# Altium project 48FE+2GE+2SFP.PrjPcb (part 5 of 9)

## Sheet 17_FE_PORT_17-24.SchDoc
size 594 x 420 mm; Author: Serbinov O.A.; CompanyName: ELSICOM; DrawnBy: Serbinov O.A.; Engineer: Serbinov O.A.; Organization: Elsicom; Address1: Kirova avenue, 58; Address2: Tomsk; Address3: Russia 634012; DocumentNumber: 18; SheetNumber: 18; SheetTotal: 44; ProjectName: 48_PORTS
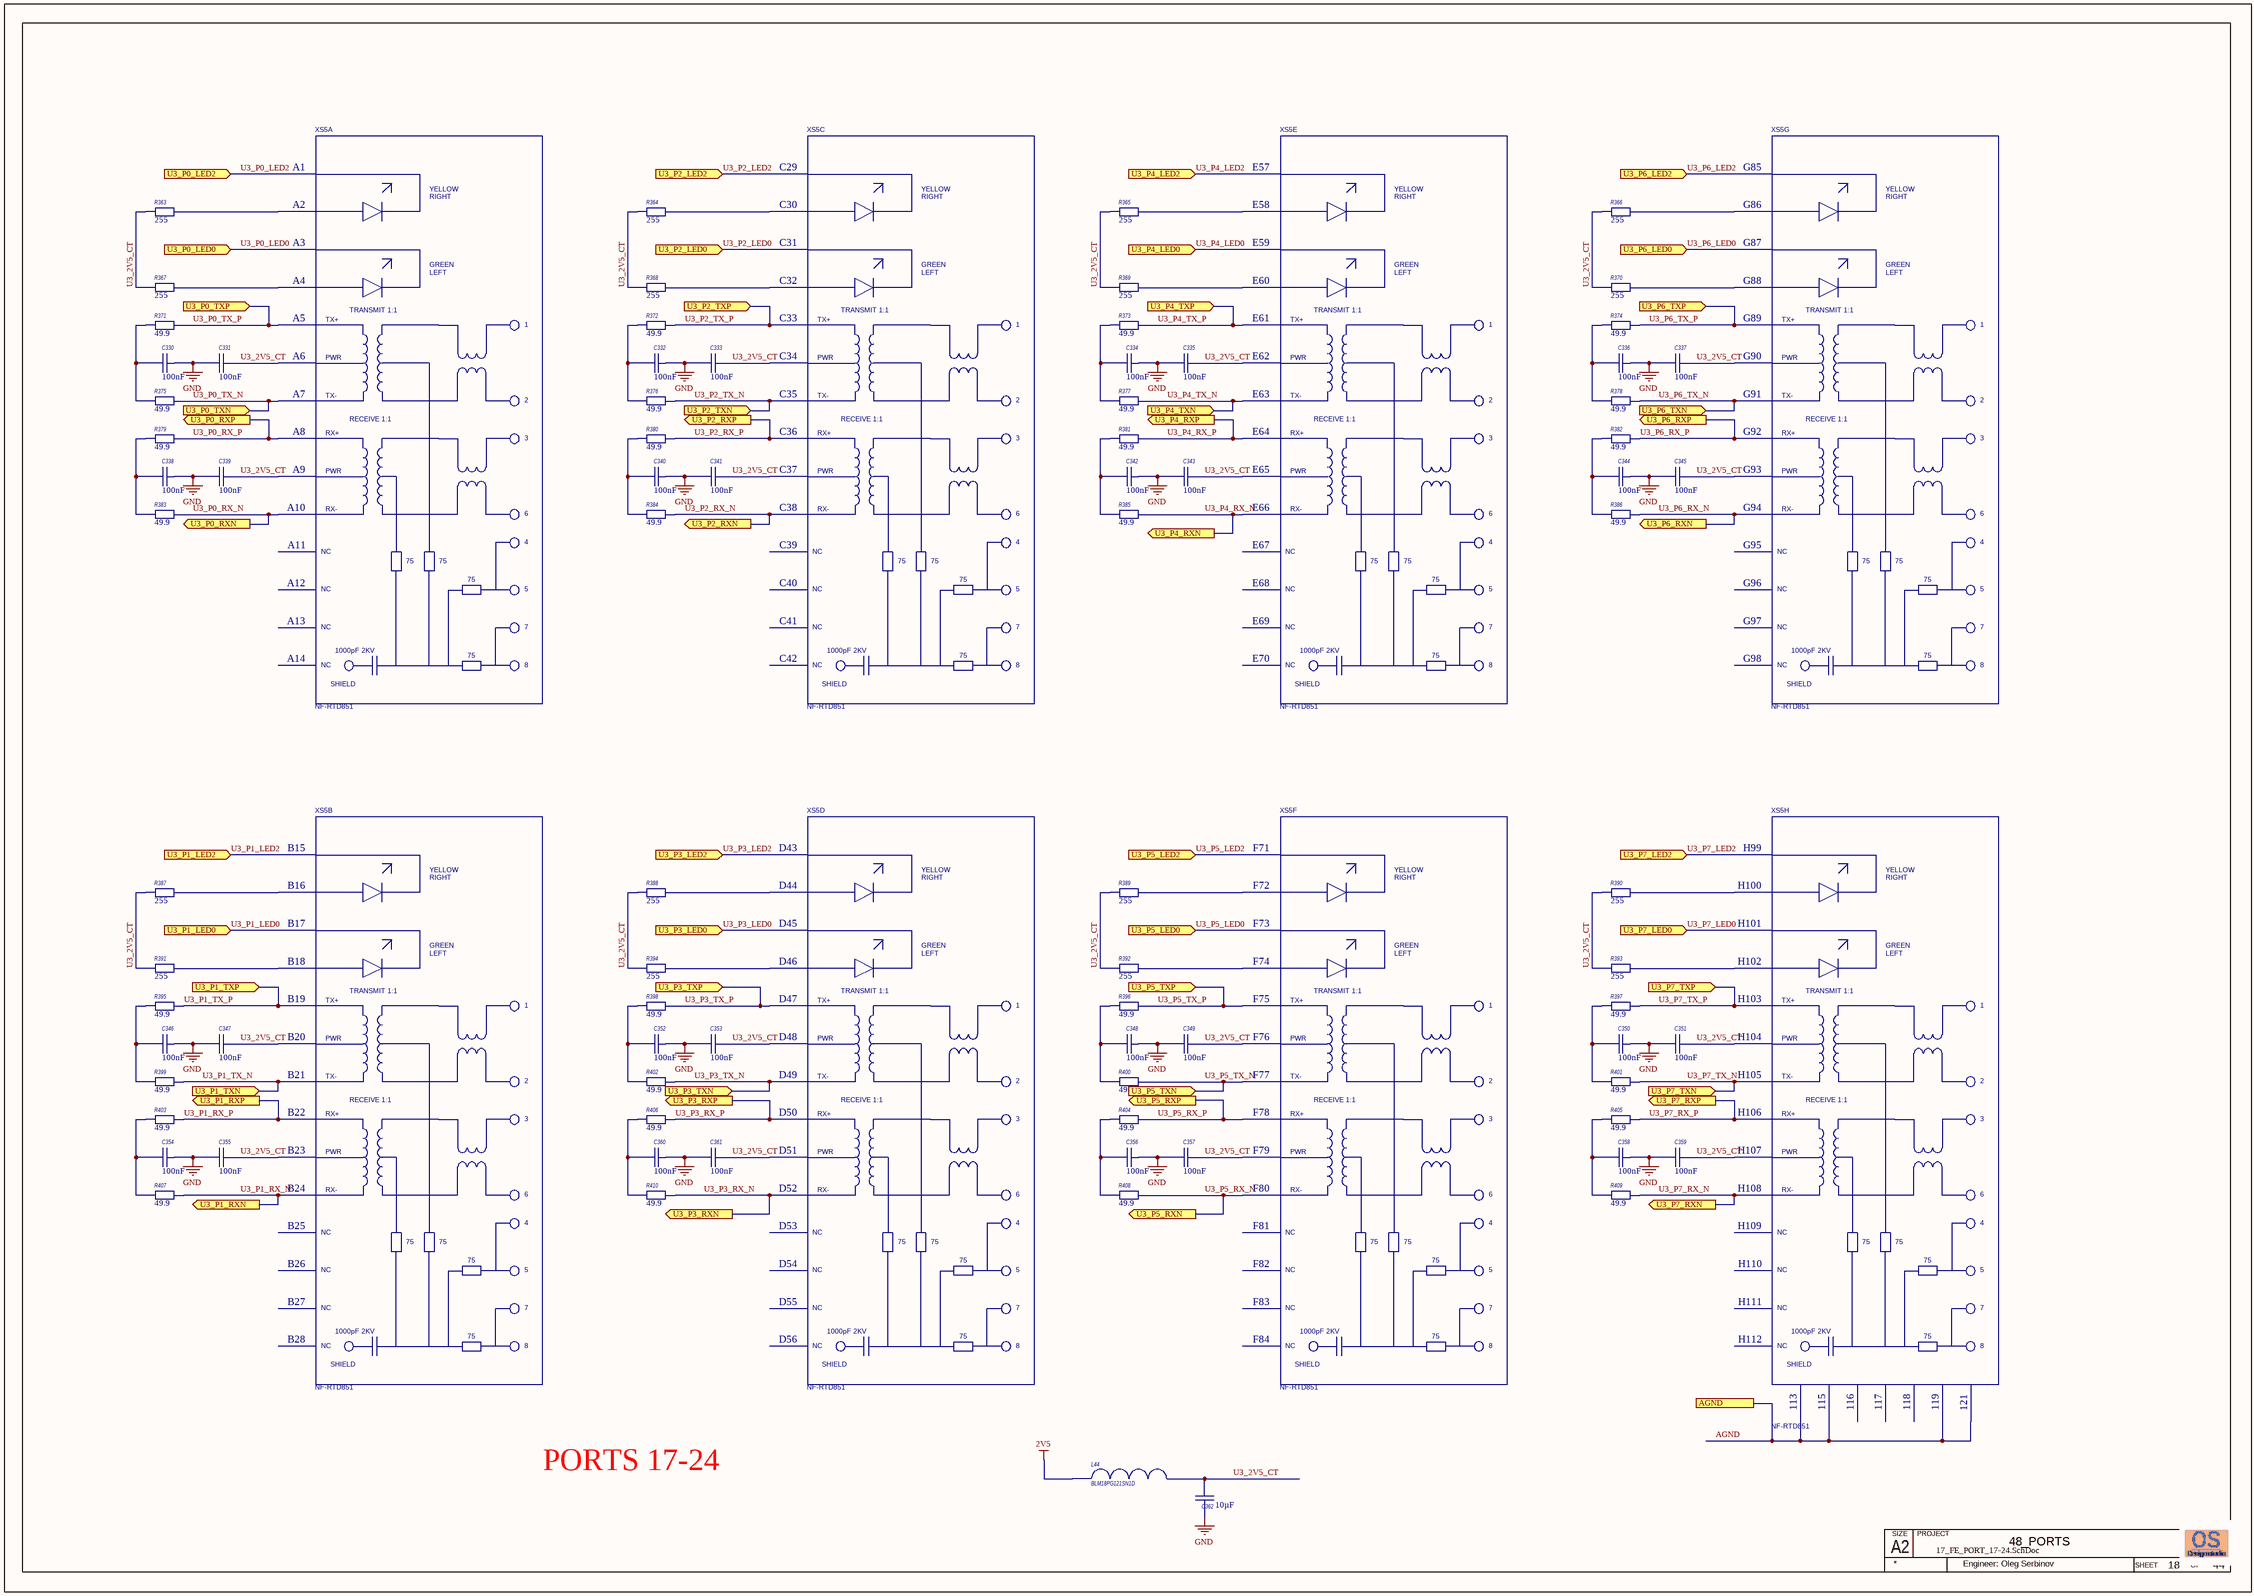
[diagram p11: 17_FE_PORT_17-24.SchDoc]

### Parts
C330  Capacitance: 100nF  [C0402_IPC High Density]  (hidden comment: GRM155R71E104KE14D)
C331  Capacitance: 100nF  [C0402_IPC High Density]  (hidden comment: GRM155R71E104KE14D)
C332  Capacitance: 100nF  [C0402_IPC High Density]  (hidden comment: GRM155R71E104KE14D)
C333  Capacitance: 100nF  [C0402_IPC High Density]  (hidden comment: GRM155R71E104KE14D)
C334  Capacitance: 100nF  [C0402_IPC High Density]  (hidden comment: GRM155R71E104KE14D)
C335  Capacitance: 100nF  [C0402_IPC High Density]  (hidden comment: GRM155R71E104KE14D)
C336  Capacitance: 100nF  [C0402_IPC High Density]  (hidden comment: GRM155R71E104KE14D)
C337  Capacitance: 100nF  [C0402_IPC High Density]  (hidden comment: GRM155R71E104KE14D)
C338  Capacitance: 100nF  [C0402_IPC High Density]  (hidden comment: GRM155R71E104KE14D)
C339  Capacitance: 100nF  [C0402_IPC High Density]  (hidden comment: GRM155R71E104KE14D)
C340  Capacitance: 100nF  [C0402_IPC High Density]  (hidden comment: GRM155R71E104KE14D)
C341  Capacitance: 100nF  [C0402_IPC High Density]  (hidden comment: GRM155R71E104KE14D)
C342  Capacitance: 100nF  [C0402_IPC High Density]  (hidden comment: GRM155R71E104KE14D)
C343  Capacitance: 100nF  [C0402_IPC High Density]  (hidden comment: GRM155R71E104KE14D)
C344  Capacitance: 100nF  [C0402_IPC High Density]  (hidden comment: GRM155R71E104KE14D)
C345  Capacitance: 100nF  [C0402_IPC High Density]  (hidden comment: GRM155R71E104KE14D)
C346  Capacitance: 100nF  [C0402_IPC High Density]  (hidden comment: GRM155R71E104KE14D)
C347  Capacitance: 100nF  [C0402_IPC High Density]  (hidden comment: GRM155R71E104KE14D)
C348  Capacitance: 100nF  [C0402_IPC High Density]  (hidden comment: GRM155R71E104KE14D)
C349  Capacitance: 100nF  [C0402_IPC High Density]  (hidden comment: GRM155R71E104KE14D)
C350  Capacitance: 100nF  [C0402_IPC High Density]  (hidden comment: GRM155R71E104KE14D)
C351  Capacitance: 100nF  [C0402_IPC High Density]  (hidden comment: GRM155R71E104KE14D)
C352  Capacitance: 100nF  [C0402_IPC High Density]  (hidden comment: GRM155R71E104KE14D)
C353  Capacitance: 100nF  [C0402_IPC High Density]  (hidden comment: GRM155R71E104KE14D)
C354  Capacitance: 100nF  [C0402_IPC High Density]  (hidden comment: GRM155R71E104KE14D)
C355  Capacitance: 100nF  [C0402_IPC High Density]  (hidden comment: GRM155R71E104KE14D)
C356  Capacitance: 100nF  [C0402_IPC High Density]  (hidden comment: GRM155R71E104KE14D)
C357  Capacitance: 100nF  [C0402_IPC High Density]  (hidden comment: GRM155R71E104KE14D)
C358  Capacitance: 100nF  [C0402_IPC High Density]  (hidden comment: GRM155R71E104KE14D)
C359  Capacitance: 100nF  [C0402_IPC High Density]  (hidden comment: GRM155R71E104KE14D)
C360  Capacitance: 100nF  [C0402_IPC High Density]  (hidden comment: GRM155R71E104KE14D)
C361  Capacitance: 100nF  [C0402_IPC High Density]  (hidden comment: GRM155R71E104KE14D)
C362  Capacitance: 10µF  [CAPC2012[0805]]  (hidden comment: GRM21BR61C106KE15)
L44  BLM18PG121SN1D  [INDC1608X95N]
R363  Resistance (Ohms): 255  [RESC1005[0402]]  (hidden comment: ERJ-2RKF2550X)
R364  Resistance (Ohms): 255  [RESC1005[0402]]  (hidden comment: ERJ-2RKF2550X)
R365  Resistance (Ohms): 255  [RESC1005[0402]]  (hidden comment: ERJ-2RKF2550X)
R366  Resistance (Ohms): 255  [RESC1005[0402]]  (hidden comment: ERJ-2RKF2550X)
R367  Resistance (Ohms): 255  [RESC1005[0402]]  (hidden comment: ERJ-2RKF2550X)
R368  Resistance (Ohms): 255  [RESC1005[0402]]  (hidden comment: ERJ-2RKF2550X)
R369  Resistance (Ohms): 255  [RESC1005[0402]]  (hidden comment: ERJ-2RKF2550X)
R370  Resistance (Ohms): 255  [RESC1005[0402]]  (hidden comment: ERJ-2RKF2550X)
R371  Resistance: 49.9  [R0402_IPC High Density]  (hidden comment: ERJ-2RKF49R9X)
R372  Resistance: 49.9  [R0402_IPC High Density]  (hidden comment: ERJ-2RKF49R9X)
R373  Resistance: 49.9  [R0402_IPC High Density]  (hidden comment: ERJ-2RKF49R9X)
R374  Resistance: 49.9  [R0402_IPC High Density]  (hidden comment: ERJ-2RKF49R9X)
R375  Resistance: 49.9  [R0402_IPC High Density]  (hidden comment: ERJ-2RKF49R9X)
R376  Resistance: 49.9  [R0402_IPC High Density]  (hidden comment: ERJ-2RKF49R9X)
R377  Resistance: 49.9  [R0402_IPC High Density]  (hidden comment: ERJ-2RKF49R9X)
R378  Resistance: 49.9  [R0402_IPC High Density]  (hidden comment: ERJ-2RKF49R9X)
R379  Resistance: 49.9  [R0402_IPC High Density]  (hidden comment: ERJ-2RKF49R9X)
R380  Resistance: 49.9  [R0402_IPC High Density]  (hidden comment: ERJ-2RKF49R9X)
R381  Resistance: 49.9  [R0402_IPC High Density]  (hidden comment: ERJ-2RKF49R9X)
R382  Resistance: 49.9  [R0402_IPC High Density]  (hidden comment: ERJ-2RKF49R9X)
R383  Resistance: 49.9  [R0402_IPC High Density]  (hidden comment: ERJ-2RKF49R9X)
R384  Resistance: 49.9  [R0402_IPC High Density]  (hidden comment: ERJ-2RKF49R9X)
R385  Resistance: 49.9  [R0402_IPC High Density]  (hidden comment: ERJ-2RKF49R9X)
R386  Resistance: 49.9  [R0402_IPC High Density]  (hidden comment: ERJ-2RKF49R9X)
R387  Resistance (Ohms): 255  [RESC1005[0402]]  (hidden comment: ERJ-2RKF2550X)
R388  Resistance (Ohms): 255  [RESC1005[0402]]  (hidden comment: ERJ-2RKF2550X)
R389  Resistance (Ohms): 255  [RESC1005[0402]]  (hidden comment: ERJ-2RKF2550X)
R390  Resistance (Ohms): 255  [RESC1005[0402]]  (hidden comment: ERJ-2RKF2550X)
R391  Resistance (Ohms): 255  [RESC1005[0402]]  (hidden comment: ERJ-2RKF2550X)
R392  Resistance (Ohms): 255  [RESC1005[0402]]  (hidden comment: ERJ-2RKF2550X)
R393  Resistance (Ohms): 255  [RESC1005[0402]]  (hidden comment: ERJ-2RKF2550X)
R394  Resistance (Ohms): 255  [RESC1005[0402]]  (hidden comment: ERJ-2RKF2550X)
R395  Resistance: 49.9  [R0402_IPC High Density]  (hidden comment: ERJ-2RKF49R9X)
R396  Resistance: 49.9  [R0402_IPC High Density]  (hidden comment: ERJ-2RKF49R9X)
R397  Resistance: 49.9  [R0402_IPC High Density]  (hidden comment: ERJ-2RKF49R9X)
R398  Resistance: 49.9  [R0402_IPC High Density]  (hidden comment: ERJ-2RKF49R9X)
R399  Resistance: 49.9  [R0402_IPC High Density]  (hidden comment: ERJ-2RKF49R9X)
R400  Resistance: 49.9  [R0402_IPC High Density]  (hidden comment: ERJ-2RKF49R9X)
R401  Resistance: 49.9  [R0402_IPC High Density]  (hidden comment: ERJ-2RKF49R9X)
R402  Resistance: 49.9  [R0402_IPC High Density]  (hidden comment: ERJ-2RKF49R9X)
R403  Resistance: 49.9  [R0402_IPC High Density]  (hidden comment: ERJ-2RKF49R9X)
R404  Resistance: 49.9  [R0402_IPC High Density]  (hidden comment: ERJ-2RKF49R9X)
R405  Resistance: 49.9  [R0402_IPC High Density]  (hidden comment: ERJ-2RKF49R9X)
R406  Resistance: 49.9  [R0402_IPC High Density]  (hidden comment: ERJ-2RKF49R9X)
R407  Resistance: 49.9  [R0402_IPC High Density]  (hidden comment: ERJ-2RKF49R9X)
R408  Resistance: 49.9  [R0402_IPC High Density]  (hidden comment: ERJ-2RKF49R9X)
R409  Resistance: 49.9  [R0402_IPC High Density]  (hidden comment: ERJ-2RKF49R9X)
R410  Resistance: 49.9  [R0402_IPC High Density]  (hidden comment: ERJ-2RKF49R9X)
XS5  NF-RTD851  [NF-RTD851_2X4_LED_NF-RTD851_2X4_LED(Primary)]  (parts A,B,C,D,E,F,G,H of 8)

### Ports
AGND, U3_P0_LED0 (in), U3_P0_LED2 (in), U3_P0_RXN (out), U3_P0_RXP (out), U3_P0_TXN (in), U3_P0_TXP (in), U3_P1_LED0 (in), U3_P1_LED2 (in), U3_P1_RXN (out), U3_P1_RXP (out), U3_P1_TXN (in), U3_P1_TXP (in), U3_P2_LED0 (in), U3_P2_LED2 (in), U3_P2_RXN (out), U3_P2_RXP (out), U3_P2_TXN (in), U3_P2_TXP (in), U3_P3_LED0 (in), U3_P3_LED2 (in), U3_P3_RXN (out), U3_P3_RXP (out), U3_P3_TXN (in), U3_P3_TXP (in), U3_P4_LED0 (in), U3_P4_LED2 (in), U3_P4_RXN (out), U3_P4_RXP (out), U3_P4_TXN (in), U3_P4_TXP (in), U3_P5_LED0 (in), U3_P5_LED2 (in), U3_P5_RXN (out), U3_P5_RXP (out), U3_P5_TXN (in), U3_P5_TXP (in), U3_P6_LED0 (in), U3_P6_LED2 (in), U3_P6_RXN (out), U3_P6_RXP (out), U3_P6_TXN (in), U3_P6_TXP (in), U3_P7_LED0 (in), U3_P7_LED2 (in), U3_P7_RXN (out), U3_P7_RXP (out), U3_P7_TXN (in), U3_P7_TXP (in)

### Nets
2V5: L44.1
GND: C330.2 C331.1 C332.2 C333.1 C334.2 C335.1 C336.2 C337.1 C338.2 C339.1 C340.2 C341.1 C342.2 C343.1 C344.2 C345.1 C346.2 C347.1 C348.2 C349.1 C350.2 C351.1 C352.2 C353.1 C354.2 C355.1 C356.2 C357.1 C358.2 C359.1 C360.2 C361.1 C362.1
AGND: XS5.113 XS5.115 XS5.119 XS5.121 ; port AGND
U3_2V5_CT: C331.2 C333.2 C335.2 C337.2 C339.2 C341.2 C343.2 C345.2 C347.2 C349.2 C351.2 C353.2 C355.2 C357.2 C359.2 C361.2 C362.2 L44.2 R363.1 R364.1 R365.1 R366.1 R367.1 R368.1 R369.1 R370.1 R387.1 R388.1 R389.1 R390.1 R391.1 R392.1 R393.1 R394.1 XS5.A6 XS5.A9 XS5.B20 XS5.B23 XS5.C34 XS5.C37 XS5.D48 XS5.D51 XS5.E62 XS5.E65 XS5.F76 XS5.F79 XS5.G90 XS5.G93 XS5.H104 XS5.H107
U3_P0_LED0: XS5.A3 ; port U3_P0_LED0
U3_P0_LED2: XS5.A1 ; port U3_P0_LED2
U3_P0_RX_N: R383.2 XS5.A10 ; port U3_P0_RXN
U3_P0_RX_P: R379.2 XS5.A8 ; port U3_P0_RXP
U3_P0_TX_N: R375.2 XS5.A7 ; port U3_P0_TXN
U3_P0_TX_P: R371.2 XS5.A5 ; port U3_P0_TXP
U3_P1_LED0: XS5.B17 ; port U3_P1_LED0
U3_P1_LED2: XS5.B15 ; port U3_P1_LED2  [project net U3_CONFIG_8]
U3_P1_RX_N: R407.2 XS5.B24 ; port U3_P1_RXN
U3_P1_RX_P: R403.2 XS5.B22 ; port U3_P1_RXP
U3_P1_TX_N: R399.2 XS5.B21 ; port U3_P1_TXN
U3_P1_TX_P: R395.2 XS5.B19 ; port U3_P1_TXP
U3_P2_LED0: XS5.C31 ; port U3_P2_LED0
U3_P2_LED2: XS5.C29 ; port U3_P2_LED2
U3_P2_RX_N: R384.2 XS5.C38 ; port U3_P2_RXN
U3_P2_RX_P: R380.2 XS5.C36 ; port U3_P2_RXP
U3_P2_TX_N: R376.2 XS5.C35 ; port U3_P2_TXN
U3_P2_TX_P: R372.2 XS5.C33 ; port U3_P2_TXP
U3_P3_LED0: XS5.D45 ; port U3_P3_LED0
U3_P3_LED2: XS5.D43 ; port U3_P3_LED2
U3_P3_RX_N: R410.2 XS5.D52 ; port U3_P3_RXN
U3_P3_RX_P: R406.2 XS5.D50 ; port U3_P3_RXP
U3_P3_TX_N: R402.2 XS5.D49 ; port U3_P3_TXN
U3_P3_TX_P: R398.2 XS5.D47 ; port U3_P3_TXP
U3_P4_LED0: XS5.E59 ; port U3_P4_LED0
U3_P4_LED2: XS5.E57 ; port U3_P4_LED2
U3_P4_RX_N: R385.2 XS5.E66 ; port U3_P4_RXN
U3_P4_RX_P: R381.2 XS5.E64 ; port U3_P4_RXP
U3_P4_TX_N: R377.2 XS5.E63 ; port U3_P4_TXN
U3_P4_TX_P: R373.2 XS5.E61 ; port U3_P4_TXP
U3_P5_LED0: XS5.F73 ; port U3_P5_LED0
U3_P5_LED2: XS5.F71 ; port U3_P5_LED2
U3_P5_RX_N: R408.2 XS5.F80 ; port U3_P5_RXN
U3_P5_RX_P: R404.2 XS5.F78 ; port U3_P5_RXP
U3_P5_TX_N: R400.2 XS5.F77 ; port U3_P5_TXN
U3_P5_TX_P: R396.2 XS5.F75 ; port U3_P5_TXP
U3_P6_LED0: XS5.G87 ; port U3_P6_LED0
U3_P6_LED2: XS5.G85 ; port U3_P6_LED2
U3_P6_RX_N: R386.2 XS5.G94 ; port U3_P6_RXN
U3_P6_RX_P: R382.2 XS5.G92 ; port U3_P6_RXP
U3_P6_TX_N: R378.2 XS5.G91 ; port U3_P6_TXN
U3_P6_TX_P: R374.2 XS5.G89 ; port U3_P6_TXP
U3_P7_LED0: XS5.H101 ; port U3_P7_LED0
U3_P7_LED2: XS5.H99 ; port U3_P7_LED2
U3_P7_RX_N: R409.2 XS5.H108 ; port U3_P7_RXN
U3_P7_RX_P: R405.2 XS5.H106 ; port U3_P7_RXP
U3_P7_TX_N: R401.2 XS5.H105 ; port U3_P7_TXN
U3_P7_TX_P: R397.2 XS5.H103 ; port U3_P7_TXP
NetC330_1: C330.1 R371.1 R375.1
NetC332_1: C332.1 R372.1 R376.1
NetC334_1: C334.1 R373.1 R377.1
NetC336_1: C336.1 R374.1 R378.1
NetC338_1: C338.1 R379.1 R383.1
NetC340_1: C340.1 R380.1 R384.1
NetC342_1: C342.1 R381.1 R385.1
NetC344_1: C344.1 R382.1 R386.1
NetC346_1: C346.1 R395.1 R399.1
NetC348_1: C348.1 R396.1 R400.1
NetC350_1: C350.1 R397.1 R401.1
NetC352_1: C352.1 R398.1 R402.1
NetC354_1: C354.1 R403.1 R407.1
NetC356_1: C356.1 R404.1 R408.1
NetC358_1: C358.1 R405.1 R409.1
NetC360_1: C360.1 R406.1 R410.1
NetR363_2: R363.2 XS5.A2
NetR364_2: R364.2 XS5.C30
NetR365_2: R365.2 XS5.E58
NetR366_2: R366.2 XS5.G86
NetR367_2: R367.2 XS5.A4
NetR368_2: R368.2 XS5.C32
NetR369_2: R369.2 XS5.E60
NetR370_2: R370.2 XS5.G88
NetR387_2: R387.2 XS5.B16
NetR388_2: R388.2 XS5.D44
NetR389_2: R389.2 XS5.F72
NetR390_2: R390.2 XS5.H100
NetR391_2: R391.2 XS5.B18
NetR392_2: R392.2 XS5.F74
NetR393_2: R393.2 XS5.H102
NetR394_2: R394.2 XS5.D46

Not connected (* = marked no-connect by the designer): XS5 114 116 117 118 120 A11 A12 A13 A14 B25 B26 B27 B28 C39 C40 C41 C42 D53 D54 D55 D56 E67 E68 E69 E70 F81 F82 F83 F84 G95 G96 G97 G98 H109 H110 H111 H112

### Notes on the sheet
- PORTS 17-24
- A2
- SIZE
- PROJECT
- SHEET
- OF
- Engineer: Oleg Serbinov
- (in symbol NF-RTD851 2X4 EMI LED, part A) YELLOW; RIGHT; GREEN; LEFT; TRANSMIT 1:1; TX+; 1; PWR; TX-; 2; RECEIVE 1:1; RX+; 3; RX-; 6; 4; NC; 75; 5; 7; 1000pF 2KV; 8; SHIELD
- (in symbol NF-RTD851 2X4 EMI LED, part B) YELLOW; RIGHT; GREEN; LEFT; TRANSMIT 1:1; TX+; 1; PWR; TX-; 2; RECEIVE 1:1; RX+; 3; RX-; 6; 4; NC; 75; 5; 7; 1000pF 2KV; 8; SHIELD
- (in symbol NF-RTD851 2X4 EMI LED, part C) YELLOW; RIGHT; GREEN; LEFT; TRANSMIT 1:1; TX+; 1; PWR; TX-; 2; RECEIVE 1:1; RX+; 3; RX-; 6; 4; NC; 75; 5; 7; 1000pF 2KV; 8; SHIELD
- (in symbol NF-RTD851 2X4 EMI LED, part D) YELLOW; RIGHT; GREEN; LEFT; TRANSMIT 1:1; TX+; 1; PWR; TX-; 2; RECEIVE 1:1; RX+; 3; RX-; 6; 4; NC; 75; 5; 7; 1000pF 2KV; 8; SHIELD
- (in symbol NF-RTD851 2X4 EMI LED, part E) YELLOW; RIGHT; GREEN; LEFT; TRANSMIT 1:1; TX+; 1; PWR; TX-; 2; RECEIVE 1:1; RX+; 3; RX-; 6; 4; NC; 75; 5; 7; 1000pF 2KV; 8; SHIELD
- (in symbol NF-RTD851 2X4 EMI LED, part F) YELLOW; RIGHT; GREEN; LEFT; TRANSMIT 1:1; TX+; 1; PWR; TX-; 2; RECEIVE 1:1; RX+; 3; RX-; 6; 4; NC; 75; 5; 7; 1000pF 2KV; 8; SHIELD
- (in symbol NF-RTD851 2X4 EMI LED, part G) YELLOW; RIGHT; GREEN; LEFT; TRANSMIT 1:1; TX+; 1; PWR; TX-; 2; RECEIVE 1:1; RX+; 3; RX-; 6; 4; NC; 75; 5; 7; 1000pF 2KV; 8; SHIELD
- (in symbol NF-RTD851 2X4 EMI LED, part H) YELLOW; RIGHT; GREEN; LEFT; TRANSMIT 1:1; TX+; 1; PWR; TX-; 2; RECEIVE 1:1; RX+; 3; RX-; 6; 4; NC; 75; 5; 7; 1000pF 2KV; 8; SHIELD

### Library data of the parts
C330-C361 = GRM155R71E104KE14D: C0402, 100nF, 25V, X7R; Manufacturer: Murata; Rmanufacturer: Yageo  Samsung  TDK  Taiyo Yuden  Kemet; Customer Part Number: Конденсатор, 100n, 0402, 25V, X7R, 10%; Capacitance Tolerance: ± 10%; Voltage Rating: 16; Capacitor Case Style: 0402 [1005 Metric]; Capacitor Terminals: SMD; SVHC: No SVHC (19-Dec-2012); No. of Pins: 2; Reel Quantity: 10000; Tolerance +: 10%; Analogs: any suitable; Manufacturer Part Number: GRM155R71E104KE14D; RoHS: YES; Packaging: Reel; Package / Case: 0402; ComponentLink1URL: http://www.farnell.com/datasheets/4360.pdf; ComponentLink1Description: http://www.farnell.com/datasheets/4360.pdf; Pricing: 10000=0.008593, 30000=0.007991 (GBP); Supplier 1: Farnell; Supplier Part Number 1: 1118151; Stock: 3; Dielectric Characteristic: X7R; Operating Temperature Min: -55; Operating Temperature Max: 125; Operating Temperature Range: -55°C to +125; Series: GRM Hi-Cap; Terminal Type: Surface Mount (SMD, SMT); Tolerance -: 10%; Voltage Rating V DC: 16
C362 = GRM21BR61C106KE15: C0805, 10uF 10%, 16V, X5R; Manufacturer: Murata; Customer Part Number: Конденсатор, 10u, 0805, 16V, X5R, 10%; Analogs: any suitable; Applications: General Purpose; Category: Capacitors; Operating Temperature: -55°C ~ 85°C; Package / Case: 0805 (2012 Metric); Size / Dimension: 0.079" L x 0.049" W (2.00mm x 1.25mm); Temperature Coefficient: X5R; Tolerance: ±10%; ComponentLink1URL: http://search.murata.co.jp/Ceramy/image/img/PDF/ENG/GRM21BR61C106KE15.pdf; ComponentLink1Description: http://search.murata.co.jp/Ceramy/image/img/PDF/ENG/GRM21BR61C106KE15.pdf; Pricing: 1=0.3, 10=0.25, 50=0.1408, 100=0.1252, 250=0.09392, 500=0.08294, 1000=0.07356 (USD); Voltage - Rated: 16V; Manufacturer Part Number: GRM21BR61C106KE15
L44 = BLM18PG121SN1D: FILTER BLM18 (0603, 2A); Manufacturer: Murata; Rpart number: MPZ1608S121ATAH0 ; CIC10P121NC ; MPZ1608S121ATDH5 ; BLM18PG121SH1D ; 742792625; Rmanufacturer: Boruns  Samsung  TDK  Murata  Wurth Electronics; Customer Part Number: Дроссель, BLM18PG121SN1D, FERRITE BEAD 120 OHM 1LN, 0603; DC Resistance Max: 0.05; Impedance: 120; Ferrite Mounting: SMD; Inductor Type: Ferrite Bead; SVHC: No SVHC (19-Dec-2011); Ferrite Case Style: 0603 / 1608; Core Material: Ferrite; DC Current Max: 2000; Inductor Case Style: 0603; Inductance Tolerance: ± 25%; No. of Pins: 2; RoHS: YES; Operating Temperature Min: -55; Mounting Type: SMD; Operating Temperature Max: +125; Package / Case: 0603; Impedance @ 100MHz Typ: 120; Resistance: 0.05; Supplier Part Number: 1515738; Supplier: Farnell; ComponentLink1URL: http://www.farnell.com/datasheets/5148.pdf; ComponentLink1Description: http://www.farnell.com/datasheets/5148.pdf; Pricing: 5=0.056, 50=0.041, 100=0.034, 250=0.028, 500=0.027 (GBP); Manufacturer Part Number: BLM18PG121SN1D; DC Current Rating: 2A; Analogs: MPZ1608S121ATAH0 ; CIC10P121NC ; MPZ1608S121ATDH5 ; BLM18PG121SH1D ; 742792625
R363-R370 R387-R394 = ERJ-2RKF2550X: R0402, 255R 1%; Manufacturer: Panasonic; Customer Part Number: Резистор, 255R, 0402, 1%; Temperature Coefficient: ±100ppm/°C; Power (Watts): 0.1W, 1/10W; Analogs: any suitable; Category: Resistors; Supplier: Digi-Key; Supplier Part Number: P255LDKR-ND; RoHS: RoHS Compliant; Manufacturer Part Number: ERJ-2RKF2550X; Packaging: Digi-Reel®; Composition: Thick Film; Number of Terminations: 2; Height: 0.016" (0.40mm); Size / Dimension: 0.039" L x 0.020" W (1.00mm x 0.50mm); Tolerance: ±1%; Features: -; Package / Case: 0402 (1005 Metric); ComponentLink1URL: http://industrial.panasonic.com/www-cgi/jvcr13pz.cgi?E+PZ+3+AOA0002+ERJ2RKF2550X+7+WW; ComponentLink1Description: http://industrial.panasonic.com/www-cgi/jvcr13pz.cgi?E+PZ+3+AOA0002+ERJ2RKF2550X+7+WW; Pricing: 1=0.1, 50=0.0242, 100=0.0184, 250=0.01364, 500=0.01008, 1000=0.00672, 5000=0.00473 (USD)
R371-R386 R395-R410 = ERJ-2RKF49R9X: R0402, 49.9R 1%; Manufacturer: Panasonic; Rpart number: RC0402FR-0749R9L ; RC1005F49R9CS ; MCR01MRTF49R9 ; CRCW040249R9FKED ; CR0402-FX-49R9GLF; Rmanufacturer: Yageo  Samsung  Stackpole Electronics  Rohm Semiconductor  Vishay Dale; Customer Part Number: Резистор, 49R9, 0402, 1%; Temperature Coefficient: 100 PPM / C; Voltage Rating: 50 Volts; Power Rating: 100 mWatts; Analogs: any suitable; Category: Thick Film Resistors - SMD; Supplier: Mouser; Supplier Part Number: 667-ERJ-2RKF49R9X; Manufacturer Part Number: ERJ-2RKF49R9X; Product Category: .; Minimum Order Quantity: 1; Series: ERJ; Product: Thick Film Resistors SMD; RoHS - Mouser: E; Reeling: True; Packaging: Reel; Termination Style: SMD/SMT; Package / Case: 0402 (1005 metric); Standard Pack Qty: 10000; Tolerance: 1 %; Operating Temperature Range: - 55 C to + 155 C; RoHS: RoHS Compliant By Exemption; Dimensions: 0.5 mm W x 1 mm L x 0.35 mm H; ComponentLink1URL: http://industrial.panasonic.com/www-data/pdf/AOA0000/AOA0000CE2.pdf; ComponentLink1Description: http://industrial.panasonic.com/www-data/pdf/AOA0000/AOA0000CE2.pdf; Pricing: 1=0.135, 25=0.032, 100=0.024, 250=0.018, 500=0.014, 1000=0.008, 2000=0.007, 5000=0.004 (AUD)
XS5 = NF-RTD851 2X4 EMI LED: Connector RJ45 100mb 8 ports and led  NF-RTD851; Customer Part Number: Разъем, NF-RTD851, CONN MAGJACK 8PORT 100 BASE-TX; Manufacturer: Shenzhen Newfly Electronics; NF-RTD851 2X4 EMI LED: NF-RTD851 2X4 EMI LED (100mb 8 ports and led); Analogs: SC863-F4-48-4222-C12, F4-48-4222-C12, 9812G-81015-8-S3L1TC-D; Manufacturer Part Number: NF-RTD851

## Sheet 22_PHY_GE_PP1.SchDoc
size 419 x 296 mm; Author: Serbinov O.A.; CompanyName: ELSICOM; DrawnBy: Serbinov O.A.; Engineer: Serbinov O.A.; Organization: Elsicom; Address1: Kirova avenue, 58; Address2: Tomsk; Address3: Russia 634012; DocumentNumber: 23; SheetNumber: 23; SheetTotal: 44; ProjectName: 48_PORTS
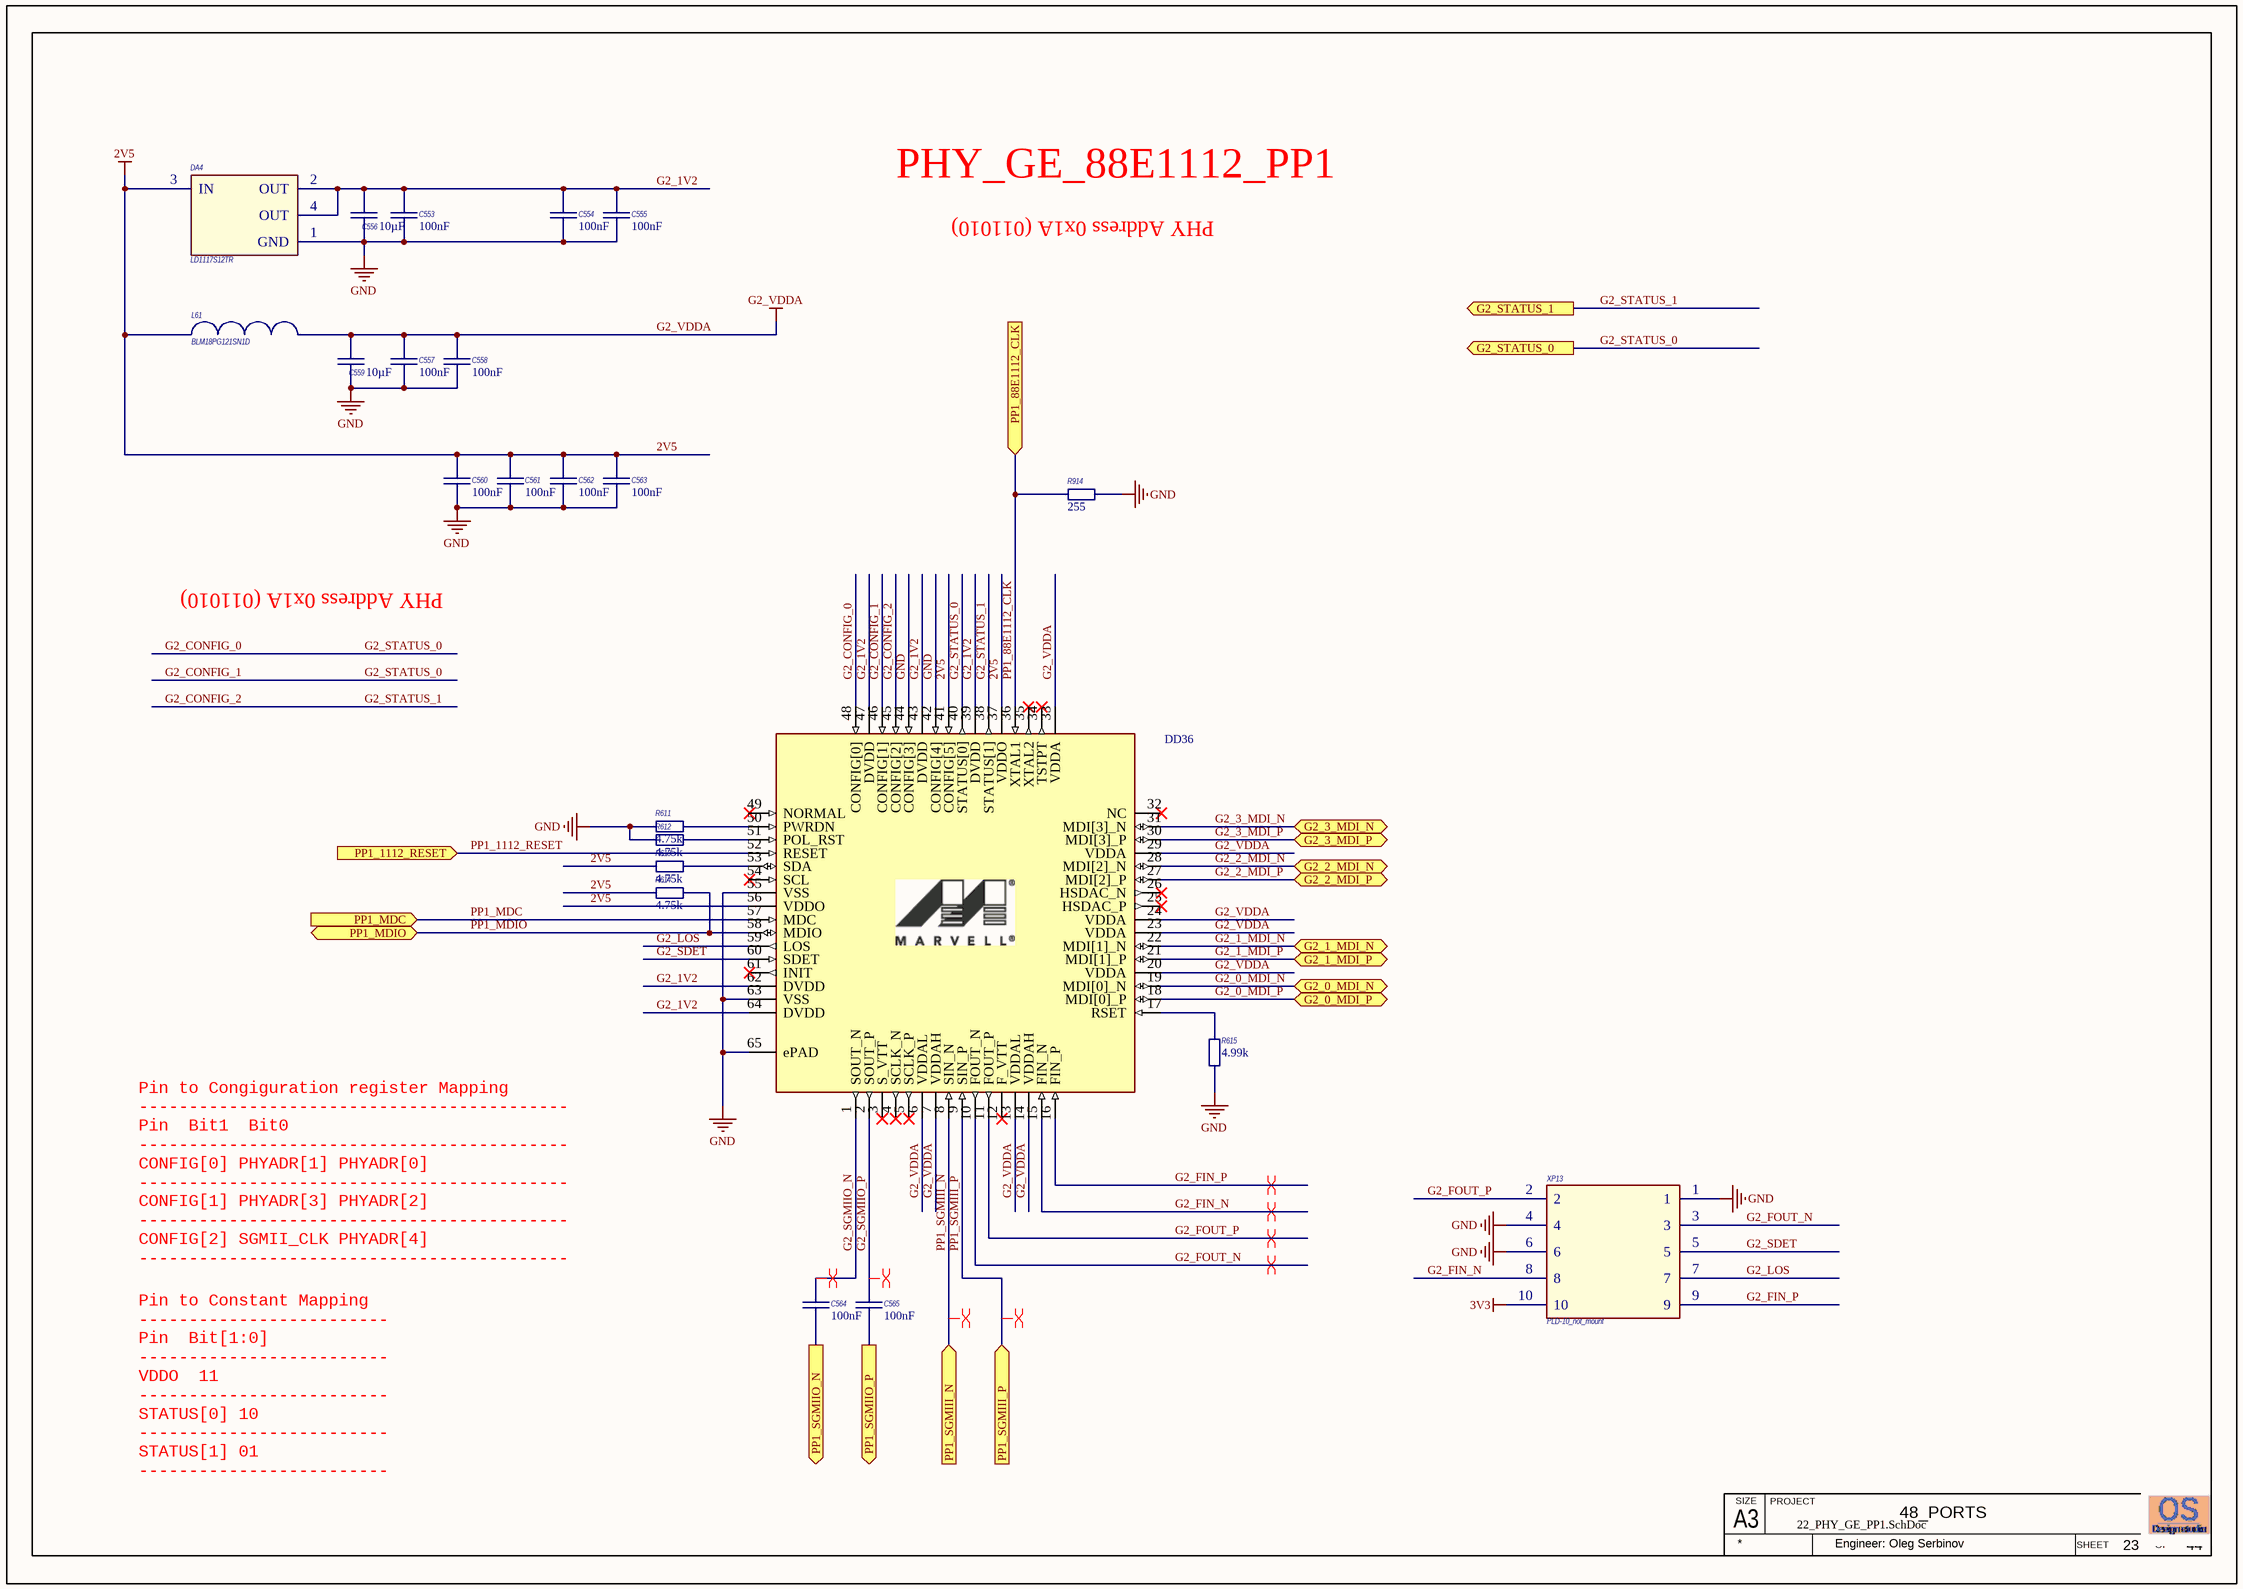
[diagram p12: 22_PHY_GE_PP1.SchDoc]

### Parts
C553  Capacitance: 100nF  [C0402_IPC High Density]  (hidden comment: GRM155R71E104KE14D)
C554  Capacitance: 100nF  [C0402_IPC High Density]  (hidden comment: GRM155R71E104KE14D)
C555  Capacitance: 100nF  [C0402_IPC High Density]  (hidden comment: GRM155R71E104KE14D)
C556  Capacitance: 10µF  [CAPC2012[0805]]  (hidden comment: GRM21BR61C106KE15)
C557  Capacitance: 100nF  [C0402_IPC High Density]  (hidden comment: GRM155R71E104KE14D)
C558  Capacitance: 100nF  [C0402_IPC High Density]  (hidden comment: GRM155R71E104KE14D)
C559  Capacitance: 10µF  [CAPC2012[0805]]  (hidden comment: GRM21BR61C106KE15)
C560  Capacitance: 100nF  [C0402_IPC High Density]  (hidden comment: GRM155R71E104KE14D)
C561  Capacitance: 100nF  [C0402_IPC High Density]  (hidden comment: GRM155R71E104KE14D)
C562  Capacitance: 100nF  [C0402_IPC High Density]  (hidden comment: GRM155R71E104KE14D)
C563  Capacitance: 100nF  [C0402_IPC High Density]  (hidden comment: GRM155R71E104KE14D)
C564  Capacitance: 100nF  [C0402_IPC High Density]  (hidden comment: GRM155R71E104KE14D)
C565  Capacitance: 100nF  [C0402_IPC High Density]  (hidden comment: GRM155R71E104KE14D)
DA4  LD1117S12TR  [SOT223_N]
DD36  88E1112-C2-NNC1  [QFN50P900X900X100-64N]  (value not drawn)
L61  BLM18PG121SN1D  [INDC1608X95N]
R611  Resistance (Ohms): 4.75k  [R0402_IPC High Density]  (hidden comment: ERJ-2RKF4751X)
R612  Resistance (Ohms): 4.75k  [R0402_IPC High Density]  (hidden comment: ERJ-2RKF4751X)
R613  Resistance (Ohms): 4.75k  [R0402_IPC High Density]  (hidden comment: ERJ-2RKF4751X)
R614  Resistance (Ohms): 4.75k  [R0402_IPC High Density]  (hidden comment: ERJ-2RKF4751X)
R615  Resistance (Ohms): 4.99k  [R0402_IPC High Density]  (hidden comment: ERJ-2RKF4991X)
R914  Resistance (Ohms): 255  [RESC1005[0402]]  (hidden comment: ERJ-2RKF2550X)
XP13  PLD-10_not_mount  [PLD-10_not_mount]

### Ports
G2_0_MDI_N (bidir), G2_0_MDI_P (bidir), G2_1_MDI_N (bidir), G2_1_MDI_P (bidir), G2_2_MDI_N (bidir), G2_2_MDI_P (bidir), G2_3_MDI_N (bidir), G2_3_MDI_P (bidir), G2_STATUS_0 (out), G2_STATUS_1 (out), PP1_88E1112_CLK (in), PP1_1112_RESET (in), PP1_MDC (in), PP1_MDIO (bidir), PP1_SGMIII_N (in), PP1_SGMIII_P (in), PP1_SGMIIO_N (out), PP1_SGMIIO_P (out)

### Nets
2V5: C560.2 C561.2 C562.2 C563.2 DA4.3(IN) DD36.37(VDDO) DD36.41(CONFIG[5]) DD36.56(VDDO) L61.1 R613.1 R614.1
3V3: XP13.10
G2_VDDA: C557.2 C558.2 C559.2 DD36.6(VDDAL) DD36.7(VDDAH) DD36.13(VDDAL) DD36.14(VDDAH) DD36.20(VDDA) DD36.23(VDDA) DD36.24(VDDA) DD36.29(VDDA) DD36.33(VDDA) L61.2
GND: C553.1 C554.1 C555.1 C556.1 C557.1 C558.1 C559.1 C560.1 C561.1 C562.1 C563.1 DA4.1(GND) DD36.42(CONFIG[4]) DD36.44(CONFIG[3]) DD36.55(VSS) DD36.63(VSS) DD36.65(ePAD) R611.1 R612.1 R615.1 R914.1 XP13.1 XP13.4 XP13.6
G2_0_MDI_N: DD36.19(MDI[0]_N) ; port G2_0_MDI_N
G2_0_MDI_P: DD36.18(MDI[0]_P) ; port G2_0_MDI_P
G2_1_MDI_N: DD36.22(MDI[1]_N) ; port G2_1_MDI_N
G2_1_MDI_P: DD36.21(MDI[1]_P) ; port G2_1_MDI_P
G2_1V2: C553.2 C554.2 C555.2 C556.2 DA4.2(OUT) DA4.4(OUT) DD36.39(DVDD) DD36.43(DVDD) DD36.47(DVDD) DD36.62(DVDD) DD36.64(DVDD)
G2_2_MDI_N: DD36.28(MDI[2]_N) ; port G2_2_MDI_N
G2_2_MDI_P: DD36.27(MDI[2]_P) ; port G2_2_MDI_P
G2_3_MDI_N: DD36.31(MDI[3]_N) ; port G2_3_MDI_N
G2_3_MDI_P: DD36.30(MDI[3]_P) ; port G2_3_MDI_P
G2_CONFIG_0: DD36.40(STATUS[0]) DD36.46(CONFIG[1]) DD36.48(CONFIG[0]) ; port G2_STATUS_0  [also labelled G2_CONFIG_1, G2_STATUS_0]
G2_CONFIG_2: DD36.38(STATUS[1]) DD36.45(CONFIG[2]) ; port G2_STATUS_1  [also labelled G2_STATUS_1]
G2_FIN_N: DD36.15(FIN_N) XP13.8
G2_FIN_P: DD36.16(FIN_P) XP13.9
G2_FOUT_N: DD36.10(FOUT_N) XP13.3
G2_FOUT_P: DD36.11(FOUT_P) XP13.2
G2_LOS: DD36.59(LOS) XP13.7
G2_SDET: DD36.60(SDET) XP13.5
G2_SGMIIO_N: C564.1 DD36.1(SOUT_N)
G2_SGMIIO_P: C565.1 DD36.2(SOUT_P)
PP1_88E1112_CLK: DD36.36(XTAL1) R914.2 ; port PP1_88E1112_CLK
PP1_1112_RESET: DD36.52(RESET) ; port PP1_1112_RESET
PP1_MDC: DD36.57(MDC) ; port PP1_MDC
PP1_MDIO: DD36.58(MDIO) R614.2 ; port PP1_MDIO
PP1_SGMIII_N: DD36.8(SIN_N) ; port PP1_SGMIII_N
PP1_SGMIII_P: DD36.9(SIN_P) ; port PP1_SGMIII_P
NetC564_2: C564.2 ; port PP1_SGMIIO_N
NetC565_2: C565.2 ; port PP1_SGMIIO_P
NetDD36_17: DD36.17(RSET) R615.2
NetDD36_50: DD36.50(PWRDN) R611.2
NetDD36_51: DD36.51(POL_RST) R612.2
NetDD36_53: DD36.53(SDA) R613.2

Not connected (* = marked no-connect by the designer): DD36 3(S_VTT)* 4(SCLK_N)* 5(SCLK_P)* 12(F_VTT)* 25(HSDAC_P)* 26(HSDAC_N)* 32(NC)* 34(TSTPT)* 35(XTAL2)* 49(NORMAL)* 54(SCL)* 61(INIT)*

### Layout directives
differential pair: G2_FIN_N, G2_FIN_P, G2_FOUT_N, G2_FOUT_P, G2_SGMIIO_N, G2_SGMIIO_P, PP1_SGMIII_N, PP1_SGMIII_P

### Notes on the sheet
- PHY_GE_88E1112_PP1
- PHY Address 0x1A (011010)
- Pin to Congiguration register Mapping
  -------------------------------------------
  Pin		Bit1		Bit0
  -------------------------------------------
  CONFIG[0]	PHYADR[1]	PHYADR[0]
  -------------------------------------------
  CONFIG[1]	PHYADR[3]	PHYADR[2]
  -------------------------------------------
  CONFIG[2]	SGMII_CLK	PHYADR[4]
  -------------------------------------------
  CONFIG[3]	SEL_TWSI	SEL_VTT
  -------------------------------------------
  CONFIG[4]	EEPROM[1]	EEPROM[2]
  ------------------------------------------
- Pin to Constant Mapping
  -------------------------
  Pin		Bit[1:0]
  -------------------------
  VDDO		11
  -------------------------
  STATUS[0]	10
  -------------------------
  STATUS[1]	01
  -------------------------
  VSS		00
  -------------------------
- A3
- SIZE
- PROJECT
- SHEET
- OF
- Engineer: Oleg Serbinov

### Library data of the parts
C553-C555 C557 C558 C560-C565 = GRM155R71E104KE14D: as C330-C361 on sheet 17_FE_PORT_17-24; Manufacturer Part Number: GRM155R71E104KE14D; RoHS: YES; Packaging: Reel; Package / Case: 0402; ComponentLink1URL: http://www.farnell.com/datasheets/4360.pdf; ComponentLink1Description: http://www.farnell.com/datasheets/4360.pdf; Pricing: 10000=0.008593, 30000=0.007991 (GBP); Supplier 1: Farnell; Supplier Part Number 1: 1118151; Stock: 3; Dielectric Characteristic: X7R; Operating Temperature Min: -55; Operating Temperature Max: 125; Operating Temperature Range: -55°C to +125; Series: GRM Hi-Cap; Terminal Type: Surface Mount (SMD, SMT); Tolerance -: 10%; Voltage Rating V DC: 16
C556 C559 = GRM21BR61C106KE15: as C362 on sheet 17_FE_PORT_17-24; Applications: General Purpose; Category: Capacitors; Operating Temperature: -55°C ~ 85°C; Package / Case: 0805 (2012 Metric); Size / Dimension: 0.079" L x 0.049" W (2.00mm x 1.25mm); Temperature Coefficient: X5R; Tolerance: ±10%; ComponentLink1URL: http://search.murata.co.jp/Ceramy/image/img/PDF/ENG/GRM21BR61C106KE15.pdf; ComponentLink1Description: http://search.murata.co.jp/Ceramy/image/img/PDF/ENG/GRM21BR61C106KE15.pdf; Pricing: 1=0.3, 10=0.25, 50=0.1408, 100=0.1252, 250=0.09392, 500=0.08294, 1000=0.07356 (USD); Voltage - Rated: 16V; Manufacturer Part Number: GRM21BR61C106KE15
DA4 = LD1117S12TR: IC REG LDO 0.8A 1.2V SOT223-4; Manufacturer Part Number: LD1117S-12TR; Manufacturer: STMicroelectronics; Customer Part Number: Микросхема, LD1117S-12TR, IC REG LDO 1.2V 0.8A, SOT-223; Reference Voltage: 1.26 V; Input Voltage MAX: 15 V; Input Bias Current (Max): 5 mA; Output Current: 950 mA; Dropout Voltage (Max): 1.1 V; Line Regulation: 0.2 %; Load Regulation: 0.4 %; Maximum Power Dissipation: 12 W; Output Type: Fixed; Number of Outputs: 1; Voltage Regulation Accuracy: 1 %; LD1117S-12TR: LD1117S-12TR (SOT 223, LDO 1.2V 0.8A); Analogs: TLV117112D, LD1117AS12TR, MCP1826S-1202E/DB, AP1122EG-13, ZLDO1117G12TA, AZ1117BH-1.2TRE1; Supplier 1: Mouser; Supplier Part Number 1: 511-LD1117S12; Reeling: True; Minimum Order Quantity: 1; Category: Low Dropout (LDO) Regulators; Mounting Style: SMD/SMT; Supplier Part Number: 511-LD1117S12; Output Voltage: 1.2 V; RoHS: RoHS Compliant; Standard Pack Qty: 2500; RoHS - Mouser: Y; Packaging: Reel; Package / Case: SOT-223; Minimum Operating Temperature: 0 C; Maximum Operating Temperature: + 150 C; Supplier: Mouser; Product Category: Low Drop Voltage Regulators/Drivers; ComponentLink1URL: http://www.st.com/internet/com/TECHNICAL_RESOURCES/TECHNICAL_LITERATURE/DATASHEET/CD00000544.pdf; ComponentLink1Description: http://www.st.com/internet/com/TECHNICAL_RESOURCES/TECHNICAL_LITERATURE/DATASHEET/CD00000544.pdf; Pricing: 1=0.500, 10=0.446, 100=0.378, 250=0.358, 500=0.302, 1000=0.230, 2000=0.203, 2500=0.203, 5000=0.194, 10000=0.188 (AUD)
DD36 = 88E1112-C2-NNC1: IC GIGABIT PHY with Dual SGMII, 64-QFN Package; Manufacturer: Marvell; Manufacturer: Marvell Technology Group; Customer Part Number: Микросхема, 88E1112-C2-NNC1, IC GIGABIT PHY with Dual SGMII, 64-QFN; Manufacturer Part Number: 88E1112-C2-NNC1
L61 = BLM18PG121SN1D: as L44 on sheet 17_FE_PORT_17-24; RoHS: YES; Operating Temperature Min: -55; Mounting Type: SMD; Operating Temperature Max: +125; Package / Case: 0603; Impedance @ 100MHz Typ: 120; Resistance: 0.05; Supplier Part Number: 1515738; Supplier: Farnell; ComponentLink1URL: http://www.farnell.com/datasheets/5148.pdf; ComponentLink1Description: http://www.farnell.com/datasheets/5148.pdf; Pricing: 5=0.056, 50=0.041, 100=0.034, 250=0.028, 500=0.027 (GBP); Manufacturer Part Number: BLM18PG121SN1D; DC Current Rating: 2A; Analogs: MPZ1608S121ATAH0 ; CIC10P121NC ; MPZ1608S121ATDH5 ; BLM18PG121SH1D ; 742792625
R611-R614 = ERJ-2RKF4751X: R0402, 4.75k 1%; Manufacturer: Panasonic; Rpart number: RC0402FR-074K75L ; RC1005F4751CS ; RMCF0402FT4K75 ; CRCW04024K75FKED ; TRR01MZPF4751; Rmanufacturer: Yageo  Samsung  Stackpole Electronics  Rohm Semiconductor  Vishay Dale; Customer Part Number: Резистор, 4K75, 0402, 1%; Temperature Coefficient: ±100ppm/°C; Power (Watts): 0.1W, 1/10W; Analogs: any suitable; Tolerance: ±1%; Packaging: Cut Tape (CT); Package / Case: 0402 (1005 Metric); Category: Resistors; Manufacturer Part Number: ERJ-2RKF4751X; Supplier Part Number: P4.75KLCT-ND; RoHS: RoHS Compliant; Supplier: Digi-Key; ComponentLink1URL: http://industrial.panasonic.com/www-cgi/jvcr13pz.cgi?E+PZ+3+AOA0002+ERJ2RKF4751X+7+WW; ComponentLink1Description: http://industrial.panasonic.com/www-cgi/jvcr13pz.cgi?E+PZ+3+AOA0002+ERJ2RKF4751X+7+WW; Features: -; Composition: Thick Film; Height: 0.016" (0.40mm); Number of Terminations: 2; Supplier Device Package: 0402; Size / Dimension: 0.039" L x 0.020" W (1.00mm x 0.50mm)
R615 = ERJ-2RKF4991X: R0402, 4.99k 1%; Manufacturer: Panasonic; Customer Part Number: Резистор, 4K99, 0402, 1%; Description 1: RES 4.99K OHM 1/10W 1% 0402 SMD; Category 1: Resistors; Power (Watts): 0.1W, 1/10W; Temperature Coefficient: ±100ppm/°C; Analogs: any suitable; Supplier 1: Digi-Key; Supplier Part Number 1: P4.99KLTR-ND; RoHS 1: RoHS Compliant; Stock 1: 950000; Pricing 1: 10000=0.00347, 30000=0.00305, 50000=0.00279, 100000=0.00274 (USD); Composition: Thick Film; Features: -; Tolerance: ±1%; Package / Case: 0402 (1005 Metric); Size / Dimension: 0.039" L x 0.020" W (1.00mm x 0.50mm); Height: 0.016" (0.40mm); Number of Terminations: 2; Packaging: Tape & Reel (TR); ComponentLink1URL: http://industrial.panasonic.com/www-cgi/jvcr13pz.cgi?E+PZ+3+AOA0002+ERJ2RKF4991X+7+WW; ComponentLink1Description: http://industrial.panasonic.com/www-cgi/jvcr13pz.cgi?E+PZ+3+AOA0002+ERJ2RKF4991X+7+WW; Supplier Part Number: P4.99KLTR-ND; Manufacturer Part Number: ERJ-2RKF4991X; RoHS: RoHS Compliant; Supplier: Digi-Key; Category: Resistors; Pricing: 10000=0.00347, 30000=0.00305, 50000=0.00279, 100000=0.00274 (USD)
R914 = ERJ-2RKF2550X: as R363-R370 on sheet 17_FE_PORT_17-24; Category: Resistors; Manufacturer Part Number: ERJ-2RKF2550X; Tolerance: ±1%; Packaging: Digi-Reel®; Supplier: Digi-Key; RoHS: RoHS Compliant; Package / Case: 0402 (1005 Metric); ComponentLink1URL: http://industrial.panasonic.com/www-cgi/jvcr13pz.cgi?E+PZ+3+AOA0002+ERJ2RKF2550X+7+WW; ComponentLink1Description: http://industrial.panasonic.com/www-cgi/jvcr13pz.cgi?E+PZ+3+AOA0002+ERJ2RKF2550X+7+WW; Supplier Part Number: P255LDKR-ND; Pricing: 1=0.1, 50=0.0242, 100=0.0184, 250=0.01364, 500=0.01008, 1000=0.00672, 5000=0.00473 (USD); Composition: Thick Film; Number of Terminations: 2; Height: 0.016" (0.40mm); Size / Dimension: 0.039" L x 0.020" W (1.00mm x 0.50mm); Features: -
XP13 = PLD-10_not_mount: Connector PLD-10_not_mount; Customer Part Number: Разъем, PLD-10, 10 Positions Header Shrouded Connector 2.54mm Through Hole Gold; Analogs: any suitable; Manufacturer Part Number: PLD-10_not_mount; Notes: not_mount

## Sheet 23_SFP_PORTS.SchDoc
size 419 x 296 mm; Author: Serbinov O.A.; CompanyName: ELSICOM; DrawnBy: Serbinov O.A.; Engineer: Serbinov O.A.; Organization: Elsicom; Address1: Kirova avenue, 58; Address2: Tomsk; Address3: Russia 634012; DocumentNumber: 24; SheetNumber: 24; SheetTotal: 44; ProjectName: 48_PORTS
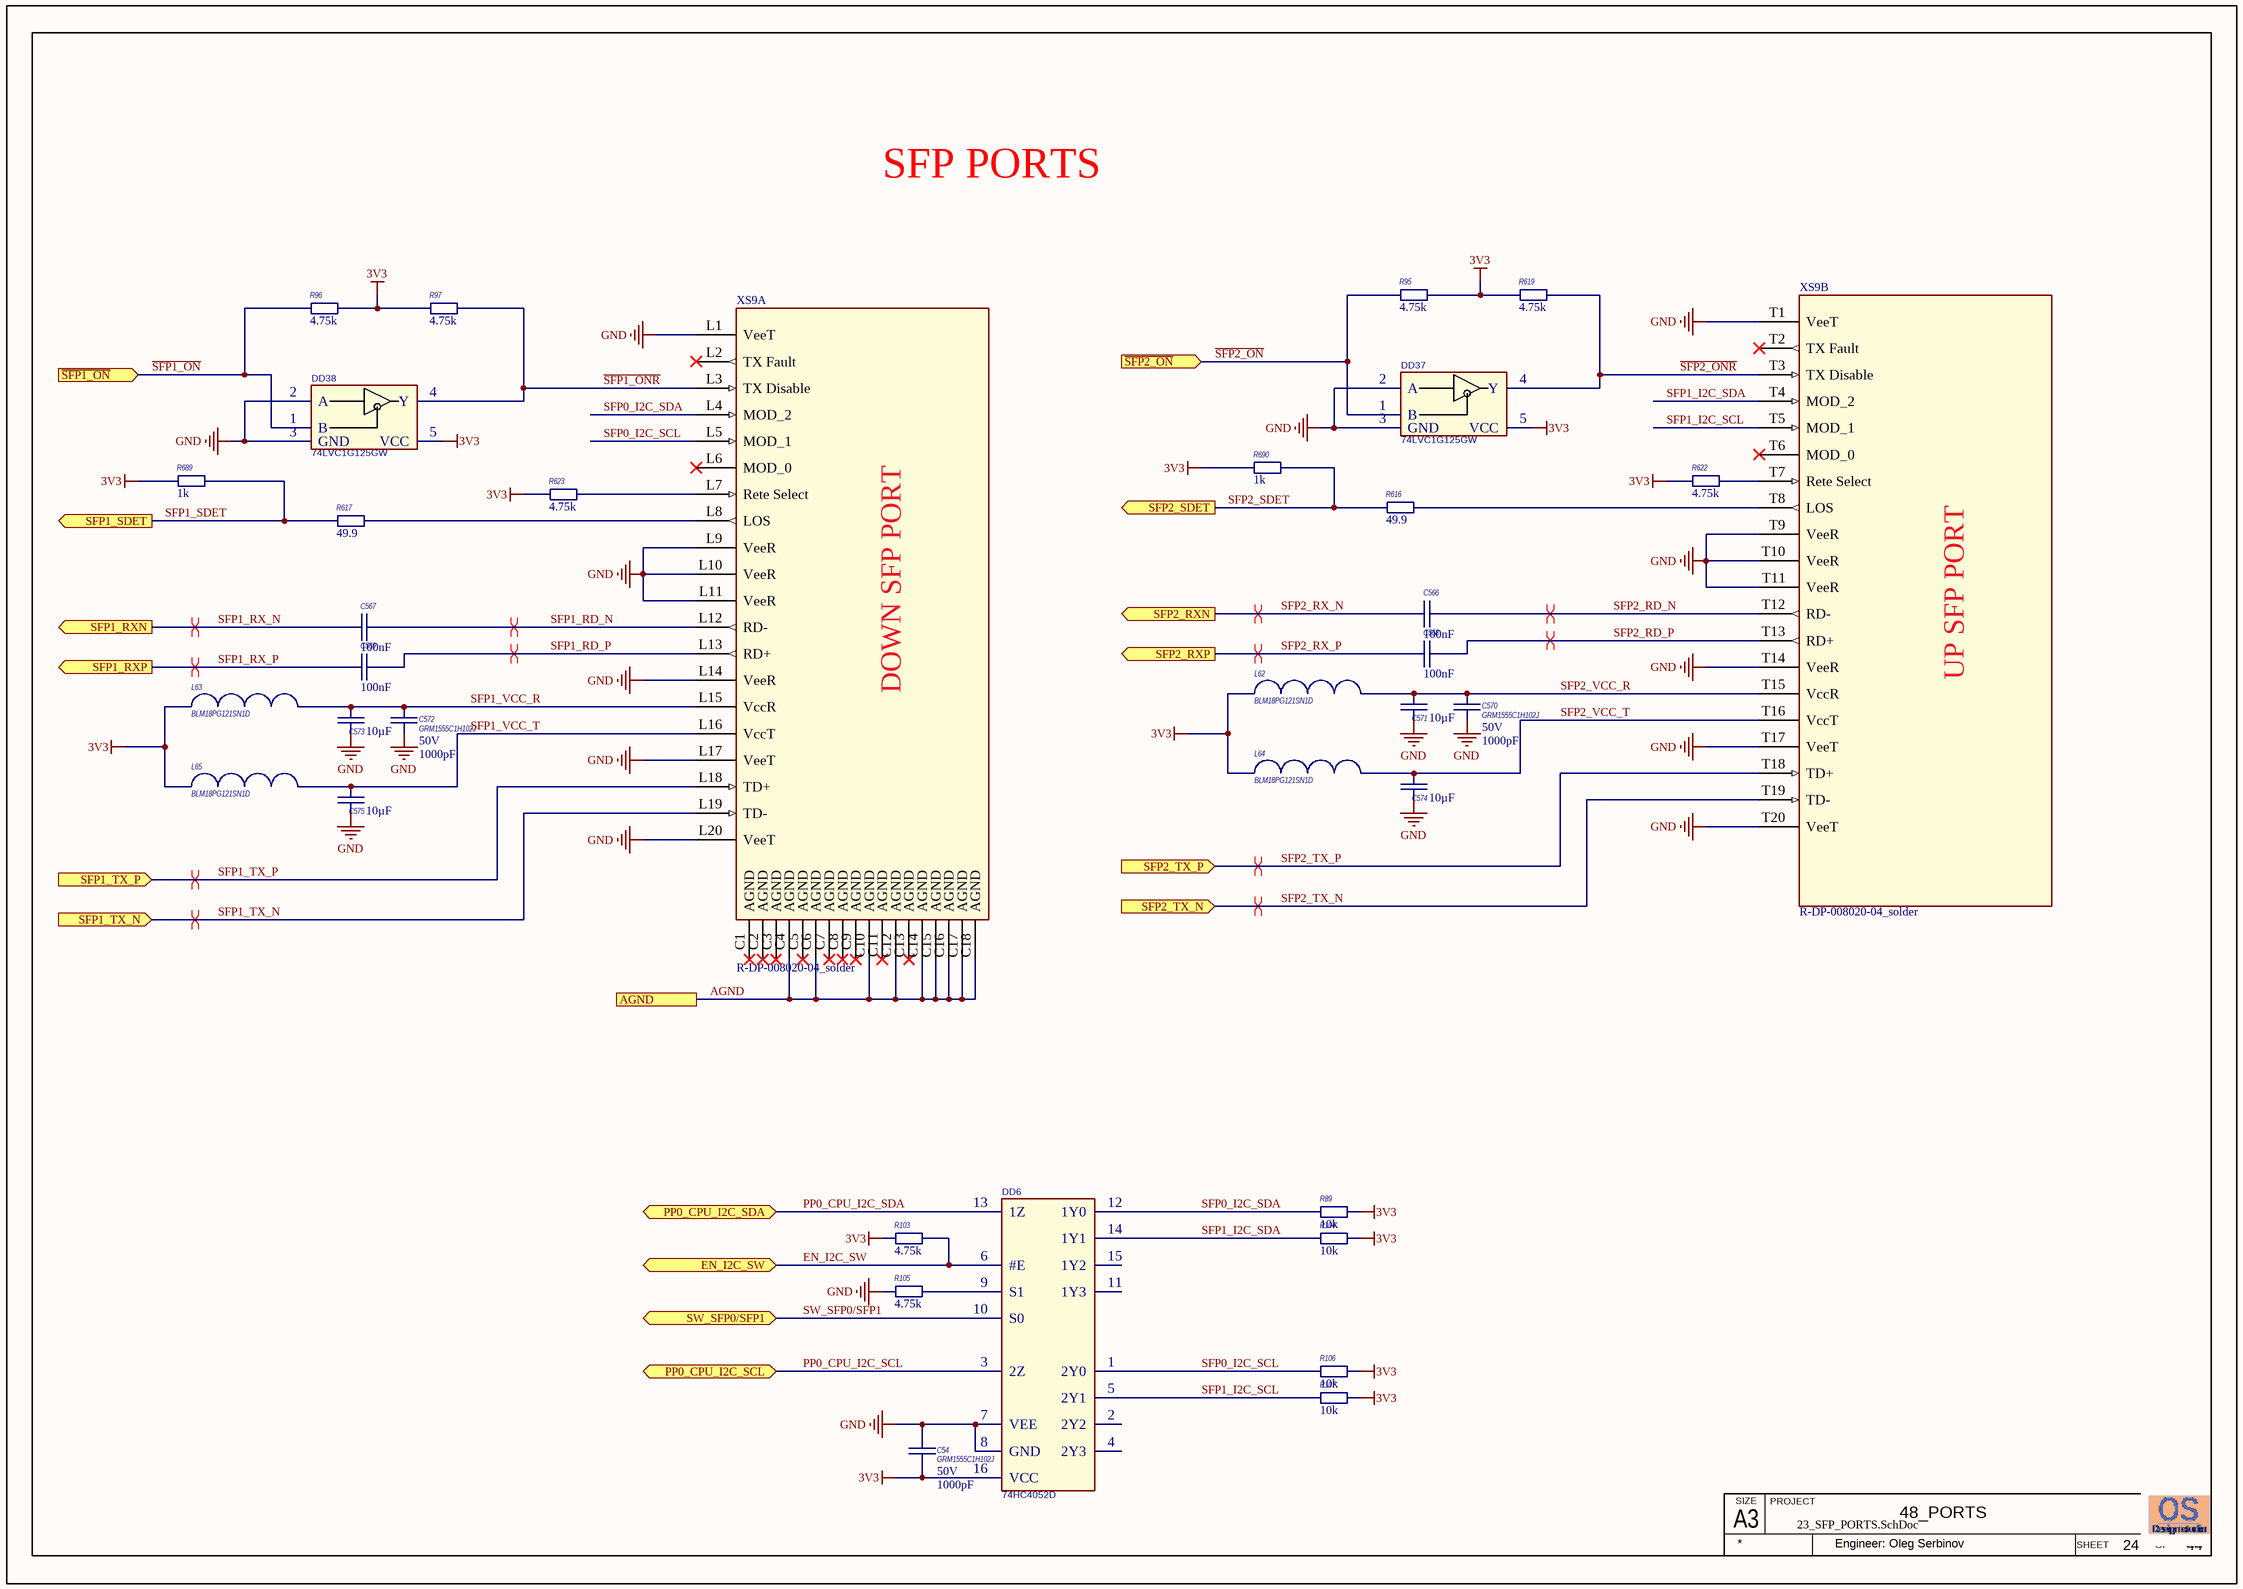
[diagram p13: 23_SFP_PORTS.SchDoc]

### Parts
C54  GRM1555C1H102J  Voltage - Rated: 50V  Capacitance: 1000pF  [CAPC1005[0402]]
C566  Capacitance: 100nF  [C0402_IPC High Density]  (hidden comment: GRM155R71E104KE14D)
C567  Capacitance: 100nF  [C0402_IPC High Density]  (hidden comment: GRM155R71E104KE14D)
C568  Capacitance: 100nF  [C0402_IPC High Density]  (hidden comment: GRM155R71E104KE14D)
C569  Capacitance: 100nF  [C0402_IPC High Density]  (hidden comment: GRM155R71E104KE14D)
C570  GRM1555C1H102J  Voltage - Rated: 50V  Capacitance: 1000pF  [CAPC1005[0402]]
C571  Capacitance: 10µF  [CAPC2012[0805]]  (hidden comment: GRM21BR61C106KE15)
C572  GRM1555C1H102J  Voltage - Rated: 50V  Capacitance: 1000pF  [CAPC1005[0402]]
C573  Capacitance: 10µF  [CAPC2012[0805]]  (hidden comment: GRM21BR61C106KE15)
C574  Capacitance: 10µF  [CAPC2012[0805]]  (hidden comment: GRM21BR61C106KE15)
C575  Capacitance: 10µF  [CAPC2012[0805]]  (hidden comment: GRM21BR61C106KE15)
DD6  74HC4052D  [SOIC-16]
DD37  74LVC1G125GW  [TSSOP5 (SOT353)]
DD38  74LVC1G125GW  [TSSOP5 (SOT353)]
L62  BLM18PG121SN1D  [INDC1608X95N]
L63  BLM18PG121SN1D  [INDC1608X95N]
L64  BLM18PG121SN1D  [INDC1608X95N]
L65  BLM18PG121SN1D  [INDC1608X95N]
R89  Resistance: 10k  [R0402_IPC High Density]  (hidden comment: ERJ-2RKF1002X)
R95  Resistance (Ohms): 4.75k  [R0402_IPC High Density]  (hidden comment: ERJ-2RKF4751X)
R96  Resistance (Ohms): 4.75k  [R0402_IPC High Density]  (hidden comment: ERJ-2RKF4751X)
R97  Resistance (Ohms): 4.75k  [R0402_IPC High Density]  (hidden comment: ERJ-2RKF4751X)
R103  Resistance (Ohms): 4.75k  [R0402_IPC High Density]  (hidden comment: ERJ-2RKF4751X)
R104  Resistance: 10k  [R0402_IPC High Density]  (hidden comment: ERJ-2RKF1002X)
R105  Resistance (Ohms): 4.75k  [R0402_IPC High Density]  (hidden comment: ERJ-2RKF4751X)
R106  Resistance: 10k  [R0402_IPC High Density]  (hidden comment: ERJ-2RKF1002X)
R107  Resistance: 10k  [R0402_IPC High Density]  (hidden comment: ERJ-2RKF1002X)
R616  Resistance: 49.9  [R0402_IPC High Density]  (hidden comment: ERJ-2RKF49R9X)
R617  Resistance: 49.9  [R0402_IPC High Density]  (hidden comment: ERJ-2RKF49R9X)
R619  Resistance (Ohms): 4.75k  [R0402_IPC High Density]  (hidden comment: ERJ-2RKF4751X)
R622  Resistance (Ohms): 4.75k  [R0402_IPC High Density]  (hidden comment: ERJ-2RKF4751X)
R623  Resistance (Ohms): 4.75k  [R0402_IPC High Density]  (hidden comment: ERJ-2RKF4751X)
R689  Resistance: 1k  [R0402_IPC High Density]  (hidden comment: ERJ-2RKF1001X)
R690  Resistance: 1k  [R0402_IPC High Density]  (hidden comment: ERJ-2RKF1001X)
XS9  R-DP-008020-04_solder  [R-DP-008020-04_solder]  (parts A,B of 2)

### Ports
AGND, EN_I2C_SW (bidir), PP0_CPU_I2C_SCL (bidir), PP0_CPU_I2C_SDA (bidir), SFP1_RXN (out), SFP1_RXP (out), SFP1_SDET (out), SFP1_TX_N (in), SFP1_TX_P (in), SFP2_RXN (out), SFP2_RXP (out), SFP2_SDET (out), SFP2_TX_N (in), SFP2_TX_P (in), SW_SFP0/SFP1 (bidir), ~{SFP1_ON} (in), ~{SFP2_ON} (in)

### Nets
3V3: C54.2 DD6.16(VCC) DD37.5(VCC) DD38.5(VCC) L62.1 L63.1 L64.1 L65.1 R89.1 R95.2 R96.2 R97.1 R103.1 R104.1 R106.1 R107.1 R619.1 R622.1 R623.1 R689.1 R690.1
GND: C54.1 C570.1 C571.1 C572.1 C573.1 C574.2 C575.2 DD6.7(VEE) DD6.8(GND) DD37.2(A) DD37.3(GND) DD38.2(A) DD38.3(GND) R105.1 XS9.L1(VeeT) XS9.L9(VeeR) XS9.L10(VeeR) XS9.L11(VeeR) XS9.L14(VeeR) XS9.L17(VeeT) XS9.L20(VeeT) XS9.T1(VeeT) XS9.T9(VeeR) XS9.T10(VeeR) XS9.T11(VeeR) XS9.T14(VeeR) XS9.T17(VeeT) XS9.T20(VeeT)
~{SFP1_ON}: DD38.1(B) R96.1 ; port ~{SFP1_ON}
~{SFP1_ONR}: DD38.4(Y) R97.2 XS9.L3(TX_Disable)
~{SFP2_ON}: DD37.1(B) R95.1 ; port ~{SFP2_ON}
~{SFP2_ONR}: DD37.4(Y) R619.2 XS9.T3(TX_Disable)
AGND: XS9.C4(AGND) XS9.C6(AGND) XS9.C10(AGND) XS9.C12(AGND) XS9.C14(AGND) XS9.C15(AGND) XS9.C16(AGND) XS9.C17(AGND) XS9.C18(AGND) ; port AGND
EN_I2C_SW: DD6.6(#E) R103.2 ; port EN_I2C_SW
PP0_CPU_I2C_SCL: DD6.3(2Z) ; port PP0_CPU_I2C_SCL
PP0_CPU_I2C_SDA: DD6.13(1Z) ; port PP0_CPU_I2C_SDA
SFP0_I2C_SCL: DD6.1(2Y0) R106.2 XS9.L5(MOD_1)
SFP0_I2C_SDA: DD6.12(1Y0) R89.2 XS9.L4(MOD_2)
SFP1_I2C_SCL: DD6.5(2Y1) R107.2 XS9.T5(MOD_1)
SFP1_I2C_SDA: DD6.14(1Y1) R104.2 XS9.T4(MOD_2)
SFP1_RD_N: C567.1 XS9.L12(RD-)
SFP1_RD_P: C569.1 XS9.L13(RD+)
SFP1_RX_N: C567.2 ; port SFP1_RXN
SFP1_RX_P: C569.2 ; port SFP1_RXP
SFP1_SDET: R617.1 R689.2 ; port SFP1_SDET
SFP1_TX_N: XS9.L19(TD-) ; port SFP1_TX_N
SFP1_TX_P: XS9.L18(TD+) ; port SFP1_TX_P
SFP1_VCC_R: C572.2 C573.2 L63.2 XS9.L15(VccR)
SFP1_VCC_T: C575.1 L65.2 XS9.L16(VccT)
SFP2_RD_N: C566.1 XS9.T12(RD-)
SFP2_RD_P: C568.1 XS9.T13(RD+)
SFP2_RX_N: C566.2 ; port SFP2_RXN
SFP2_RX_P: C568.2 ; port SFP2_RXP
SFP2_SDET: R616.1 R690.2 ; port SFP2_SDET
SFP2_TX_N: XS9.T19(TD-) ; port SFP2_TX_N
SFP2_TX_P: XS9.T18(TD+) ; port SFP2_TX_P
SFP2_VCC_R: C570.2 C571.2 L62.2 XS9.T15(VccR)
SFP2_VCC_T: C574.1 L64.2 XS9.T16(VccT)
SW_SFP0/SFP1: DD6.10(S0) ; port SW_SFP0/SFP1
NetDD6_9: DD6.9(S1) R105.2
NetR616_2: R616.2 XS9.T8(LOS)
NetR617_2: R617.2 XS9.L8(LOS)
NetR622_2: R622.2 XS9.T7(Rete_Select)
NetR623_2: R623.2 XS9.L7(Rete_Select)

Not connected (* = marked no-connect by the designer): DD6 2(2Y2) 4(2Y3) 11(1Y3) 15(1Y2); XS9 C1(AGND)* C2(AGND)* C3(AGND)* C5(AGND)* C7(AGND)* C8(AGND)* C9(AGND)* C11(AGND)* C13(AGND)* L2(TX_Fault)* L6(MOD_0)* T2(TX_Fault)* T6(MOD_0)*

### Layout directives
differential pair: SFP1_RD_N, SFP1_RD_P, SFP1_RX_N, SFP1_RX_P, SFP1_TX_N, SFP1_TX_P, SFP2_RD_N, SFP2_RD_P, SFP2_RX_N, SFP2_RX_P, SFP2_TX_N, SFP2_TX_P

### Notes on the sheet
- SFP PORTS
- A3
- SIZE
- PROJECT
- SHEET
- OF
- Engineer: Oleg Serbinov
- (in symbol R-DP-008020-04_solder, part A) DOWN SFP PORT
- (in symbol R-DP-008020-04_solder, part B) UP SFP PORT

### Library data of the parts
C54 C570 C572 = GRM1555C1H102J: C0402, 1nF 5%, 50V, C0G; Manufacturer: Murata; Customer Part Number: Конденсатор, 1n, 0402, 50V, C0G, 5%; Temperature Coefficient: C0G, NP0; Analogs: any suitable; Packaging: Cut Tape (CT); Ratings: -; Manufacturer Part Number: GRM1555C1H102J; Tolerance: ±5%; Operating Temperature: -55°C ~ 125°C; Lead Spacing: -; Features: -; Mounting Type: Surface Mount, MLCC; Lead Style: -; Size / Dimension: 0.039" L x 0.020" W (1.00mm x 0.50mm); Height - Seated (Max): -; Thickness (Max): 0.022" (0.55mm); RoHS: RoHS Compliant; Package / Case: 0402 (1005 Metric); Applications: General Purpose; Supplier: Digi-Key; Category: Capacitors; Supplier Part Number: 490-3244-1-ND; ComponentLink1URL: http://search.murata.co.jp/Ceramy/image/img/PDF/ENG/GRM1555C1H102JA01.pdf; ComponentLink1Description: http://search.murata.co.jp/Ceramy/image/img/PDF/ENG/GRM1555C1H102JA01.pdf; Pricing: 1=0.11, 10=0.077, 50=0.0416, 100=0.0352, 250=0.0288, 500=0.02464, 1000=0.0192, 5000=0.016 (USD)
C566-C569 = GRM155R71E104KE14D: as C330-C361 on sheet 17_FE_PORT_17-24; Manufacturer Part Number: GRM155R71E104KE14D; RoHS: YES; Packaging: Reel; Package / Case: 0402; ComponentLink1URL: http://www.farnell.com/datasheets/4360.pdf; ComponentLink1Description: http://www.farnell.com/datasheets/4360.pdf; Pricing: 10000=0.008593, 30000=0.007991 (GBP); Supplier 1: Farnell; Supplier Part Number 1: 1118151; Stock: 3; Dielectric Characteristic: X7R; Operating Temperature Min: -55; Operating Temperature Max: 125; Operating Temperature Range: -55°C to +125; Series: GRM Hi-Cap; Terminal Type: Surface Mount (SMD, SMT); Tolerance -: 10%; Voltage Rating V DC: 16
C571 C573-C575 = GRM21BR61C106KE15: as C362 on sheet 17_FE_PORT_17-24; Applications: General Purpose; Category: Capacitors; Operating Temperature: -55°C ~ 85°C; Package / Case: 0805 (2012 Metric); Size / Dimension: 0.079" L x 0.049" W (2.00mm x 1.25mm); Temperature Coefficient: X5R; Tolerance: ±10%; ComponentLink1URL: http://search.murata.co.jp/Ceramy/image/img/PDF/ENG/GRM21BR61C106KE15.pdf; ComponentLink1Description: http://search.murata.co.jp/Ceramy/image/img/PDF/ENG/GRM21BR61C106KE15.pdf; Pricing: 1=0.3, 10=0.25, 50=0.1408, 100=0.1252, 250=0.09392, 500=0.08294, 1000=0.07356 (USD); Voltage - Rated: 16V; Manufacturer Part Number: GRM21BR61C106KE15
DD6 = 74HC4052D: IC MUX/DEMUX DUAL 4X1, 16SOIC; Customer Part Number: Микросхема, 74HC4052D, IC MUX/DEMUX DUAL 4X1, 16-SOIC; Manufacturer: NXP Semiconductors; Manufacturer Part Number: 74HC4052D
DD37 DD38 = 74LVC1G125GW: IC Bus buffer/line driver 3-state, TSSOP5; Manufacturer: NXP Semiconductors; Customer Part Number: Микросхема, 74LVC1G125GW, IC BUFF DVR TRI-ST N-INV, 5-TSSOP; Description 1: NXP - 74LVC1G125GW - IC, LOGIC, 74LVC1G, BUFFER, UMT5; Logic Device Type: Buffer / Line Driver, Non Inverting; Supply Voltage Range: 1.65V to 5.5; Logic Case Style: SOT-353; No. of Pins: 5; SVHC: No SVHC (18-Jun-2012); Logic Function Number: 741G125; Logic IC Base Number: 741125; Logic IC Family: LVC; Supply Voltage Max: 5.5; Supply Voltage Min: 1.65; Analogs: 74LVC1G125SE-7, SN74LVC1G125DCKT, NL17SZ125DFT2G,; Supplier 1: Farnell; Supplier Part Number 1: 1631685; RoHS 1: YES; Stock 1: 3266; Pricing 1: 1=0.134, 10=0.083, 100=0.068 (GBP); Operating Temperature Range: -40°C to +125; Logic IC Function: Bus Buffer / Line Driver 3; Package / Case: SOT-353; Termination Type: SMD; ComponentLink1URL: http://www.farnell.com/datasheets/1245559.pdf; ComponentLink1Description: http://www.farnell.com/datasheets/1245559.pdf; ComponentLink2URL: http://www.farnell.com/cad/1549315.zip; ComponentLink2Description: http://www.farnell.com/cad/1549315.zip; Supplier: Farnell; RoHS: YES; Manufacturer Part Number: 74LVC1G125GW; Supplier Part Number: 1631685; Pricing: 1=0.134, 10=0.083, 100=0.068 (GBP)
L62-L65 = BLM18PG121SN1D: as L44 on sheet 17_FE_PORT_17-24; RoHS: YES; Operating Temperature Min: -55; Mounting Type: SMD; Operating Temperature Max: +125; Package / Case: 0603; Impedance @ 100MHz Typ: 120; Resistance: 0.05; Supplier Part Number: 1515738; Supplier: Farnell; ComponentLink1URL: http://www.farnell.com/datasheets/5148.pdf; ComponentLink1Description: http://www.farnell.com/datasheets/5148.pdf; Pricing: 5=0.056, 50=0.041, 100=0.034, 250=0.028, 500=0.027 (GBP); Manufacturer Part Number: BLM18PG121SN1D; DC Current Rating: 2A; Analogs: MPZ1608S121ATAH0 ; CIC10P121NC ; MPZ1608S121ATDH5 ; BLM18PG121SH1D ; 742792625
R89 R104 R106 R107 = ERJ-2RKF1002X: R0402, 10k 1%; Manufacturer: Panasonic; Rpart number: RC0402FR-0710KL ; RC1005F103CS ; RMCF0402FT10K0 ; MCR01MZPF1002 ; MCR01MRTF1002; Rmanufacturer: Yageo  Samsung  Stackpole Electronics  Rohm Semiconductor  Vishay Dale; Customer Part Number: Резистор, 10K, 0402, 1%; Power Rating: 100 mWatts; Voltage Rating: 50 Volts; Temperature Coefficient: 100 PPM / C; Analogs: any suitable; Minimum Order Quantity: 1; Supplier Part Number: 667-ERJ-2RKF1002X; Packaging: Reel; Product: Thick Film Resistors SMD; Package / Case: 0402 (1005 metric); Category: Thick Film Resistors - SMD; Supplier: Mouser; Manufacturer Part Number: ERJ-2RKF1002X; RoHS: RoHS Compliant By Exemption; Operating Temperature Range: - 55 C to + 155 C; Dimensions: 0.5 mm W x 1 mm L x 0.35 mm H; Reeling: True; Series: ERJ; Product Category: .; Standard Pack Qty: 10000; Termination Style: SMD/SMT; Tolerance: 1 %; RoHS - Mouser: E; ComponentLink1URL: http://industrial.panasonic.com/www-data/pdf/AOA0000/AOA0000CE2.pdf; ComponentLink1Description: http://industrial.panasonic.com/www-data/pdf/AOA0000/AOA0000CE2.pdf; Pricing: 1=0.135, 25=0.032, 100=0.024, 250=0.018, 500=0.014, 1000=0.008, 2000=0.007, 5000=0.004 (AUD)
R95-R97 R103 R105 R619 R622 R623 = ERJ-2RKF4751X: as R611-R614 on sheet 22_PHY_GE_PP1; Tolerance: ±1%; Packaging: Cut Tape (CT); Package / Case: 0402 (1005 Metric); Category: Resistors; Manufacturer Part Number: ERJ-2RKF4751X; Supplier Part Number: P4.75KLCT-ND; RoHS: RoHS Compliant; Supplier: Digi-Key; ComponentLink1URL: http://industrial.panasonic.com/www-cgi/jvcr13pz.cgi?E+PZ+3+AOA0002+ERJ2RKF4751X+7+WW; ComponentLink1Description: http://industrial.panasonic.com/www-cgi/jvcr13pz.cgi?E+PZ+3+AOA0002+ERJ2RKF4751X+7+WW; Features: -; Composition: Thick Film; Height: 0.016" (0.40mm); Number of Terminations: 2; Supplier Device Package: 0402; Size / Dimension: 0.039" L x 0.020" W (1.00mm x 0.50mm)
R616 R617 = ERJ-2RKF49R9X: as R371-R386 on sheet 17_FE_PORT_17-24; Category: Thick Film Resistors - SMD; Supplier: Mouser; Supplier Part Number: 667-ERJ-2RKF49R9X; Manufacturer Part Number: ERJ-2RKF49R9X; Product Category: .; Minimum Order Quantity: 1; Series: ERJ; Product: Thick Film Resistors SMD; RoHS - Mouser: E; Reeling: True; Packaging: Reel; Termination Style: SMD/SMT; Package / Case: 0402 (1005 metric); Standard Pack Qty: 10000; Tolerance: 1 %; Operating Temperature Range: - 55 C to + 155 C; RoHS: RoHS Compliant By Exemption; Dimensions: 0.5 mm W x 1 mm L x 0.35 mm H; ComponentLink1URL: http://industrial.panasonic.com/www-data/pdf/AOA0000/AOA0000CE2.pdf; ComponentLink1Description: http://industrial.panasonic.com/www-data/pdf/AOA0000/AOA0000CE2.pdf; Pricing: 1=0.135, 25=0.032, 100=0.024, 250=0.018, 500=0.014, 1000=0.008, 2000=0.007, 5000=0.004 (AUD)
R689 R690 = ERJ-2RKF1001X: R0402, 1k 1%; Manufacturer: Panasonic; Rpart number: RC0402FR-071KL ; RC1005F102CS ; RMCF0402FT1K00 ; MCR01MRTF1001 ; CRCW04021K00FKED ; ERJ2RKF1001X; Rmanufacturer: Yageo  Samsung  Stackpole Electronics  Rohm Semiconductor  Vishay Dale; Customer Part Number: Резистор, 1K, 0402, 1%; Temperature Coefficient: 100 PPM / C; Power Rating: 100 mWatts; Voltage Rating: 50 Volts; Analogs: any suitable; Supplier: Mouser; Termination Style: SMD/SMT; Series: ERJ; Supplier Part Number: 667-ERJ-2RKF1001X; RoHS: RoHS Compliant By Exemption; Dimensions: 0.5 mm W x 1 mm L x 0.35 mm H; Package / Case: 0402 (1005 metric); Product Category: .; Manufacturer Part Number: ERJ-2RKF1001X; Packaging: Reel; Tolerance: 1 %; Operating Temperature Range: - 55 C to + 155 C; Category: Thick Film Resistors - SMD; Product: Thick Film Resistors SMD; Reeling: True; Minimum Order Quantity: 1; RoHS - Mouser: E; Standard Pack Qty: 10000; ComponentLink1URL: http://industrial.panasonic.com/www-data/pdf/AOA0000/AOA0000CE2.pdf; ComponentLink1Description: http://industrial.panasonic.com/www-data/pdf/AOA0000/AOA0000CE2.pdf; Pricing: 1=0.135, 25=0.032, 100=0.024, 250=0.018, 500=0.014, 1000=0.008, 2000=0.007, 5000=0.004 (AUD)
XS9 = R-DP-008020-04_solder: Connector SFP CAGE 2X1 PRESS FIT; Customer Part Number: Разъем, R-DP-008020-04, SFP 2X1 Stacked Cage, PRESS FIT; Manufacturer: ALL BEST; Analogs: 80480KB-0C4-10L; Manufacturer Part Number: R-DP-008020-04